# EAGLE schematic boilers (EAGLE 7.2.0)
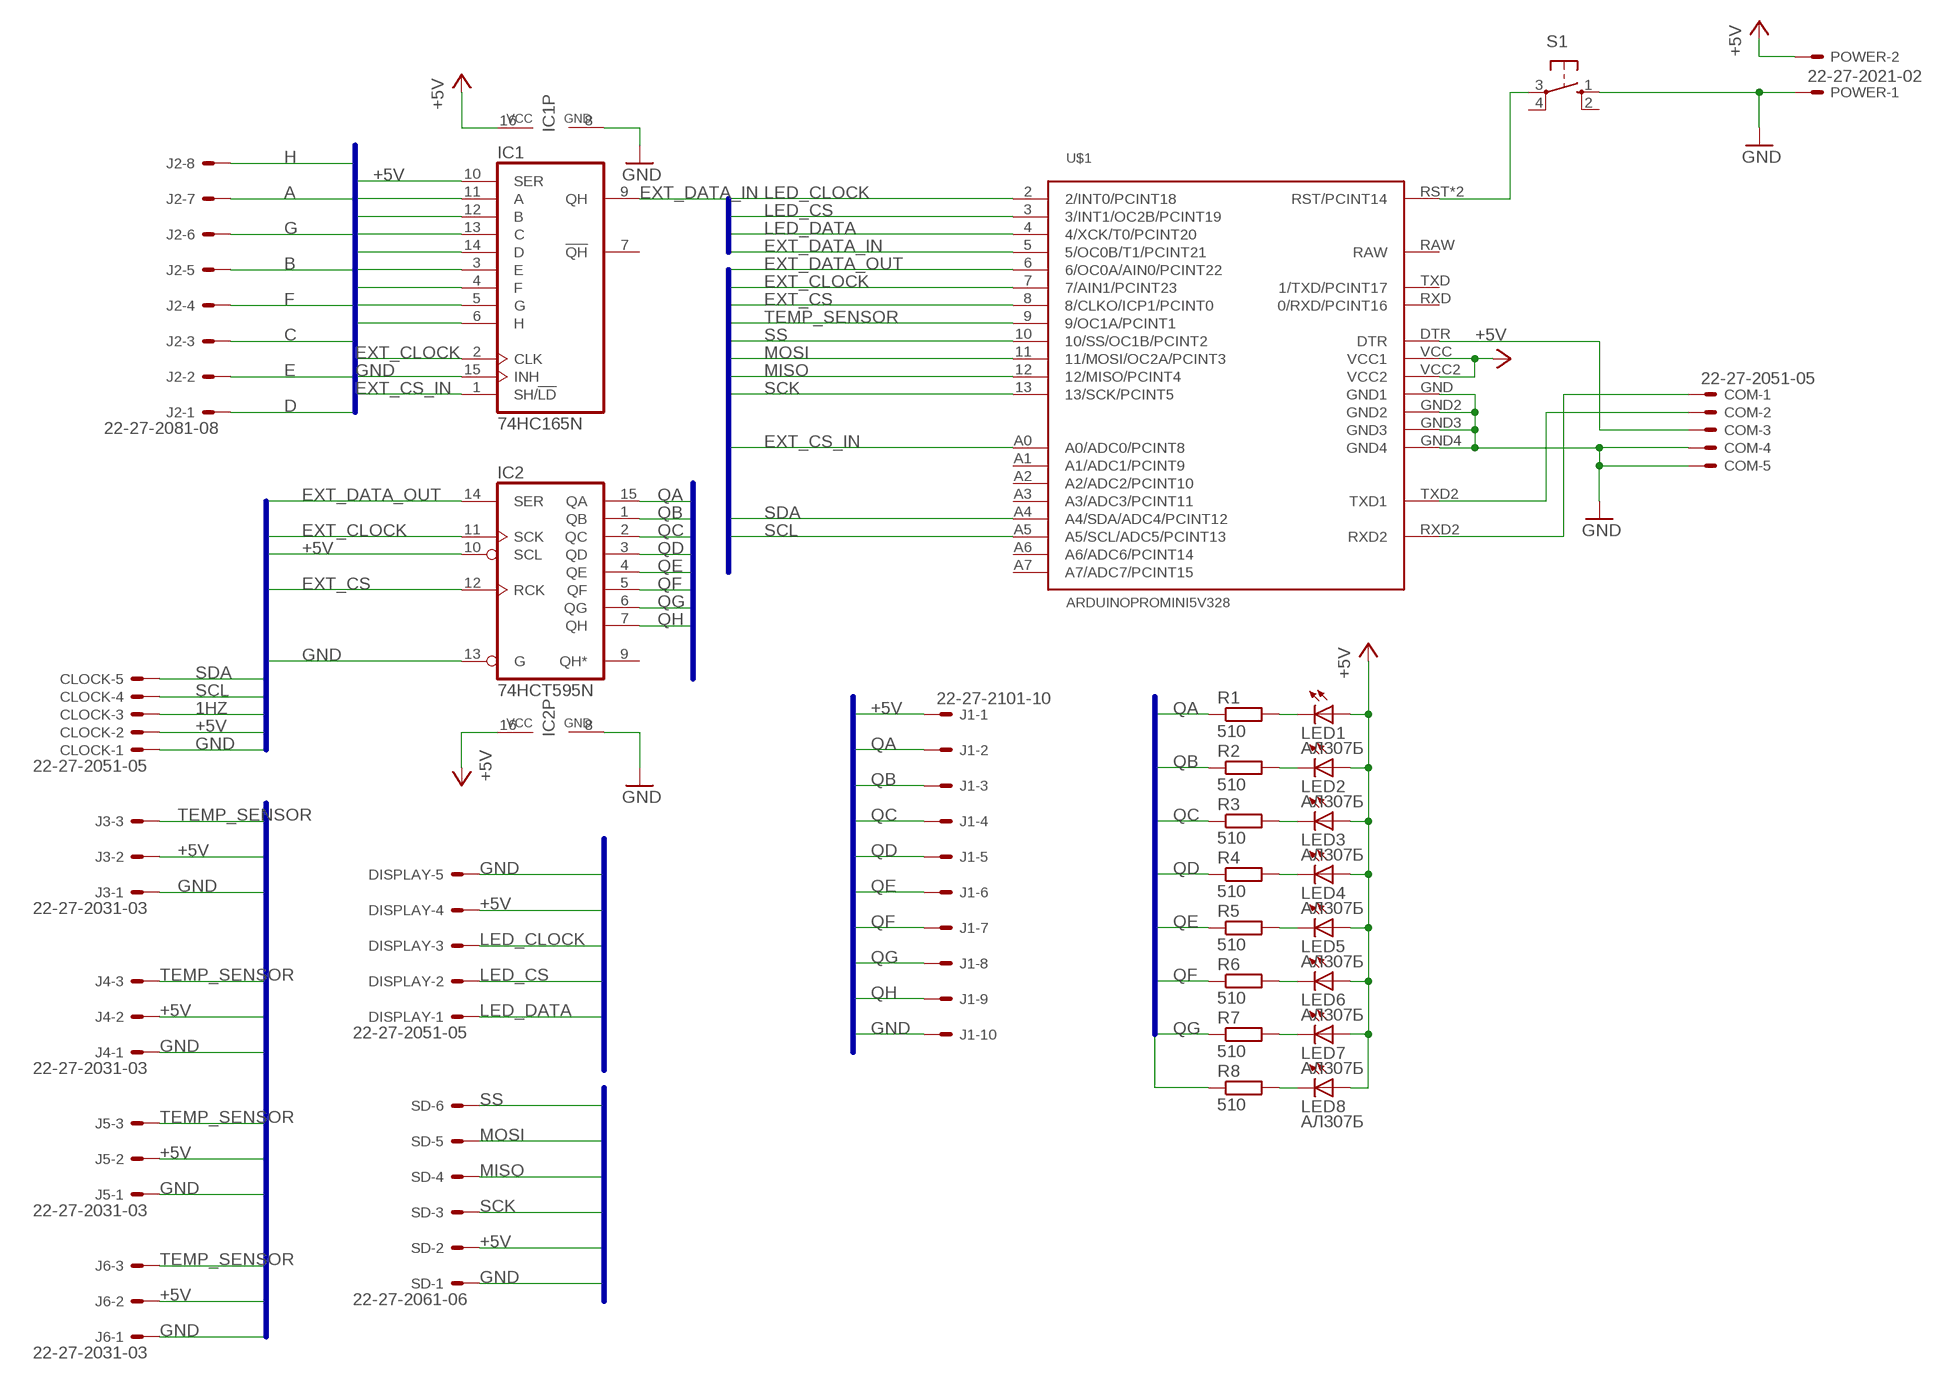
[diagram p0: schematic, sheet 1]

## Parts
CLOCK  22-27-2051-05  [6410-05]
COM  22-27-2051-05  [6410-05]
DISPLAY  22-27-2051-05  [6410-05]
IC1  74HC165N  [DIL16]
IC2  74HCT595N  [DIL16]
J1  22-27-2101-10  [6410-10]
J2  22-27-2081-08  [6410-08]
J3  22-27-2031-03  [6410-03]
J4  22-27-2031-03  [6410-03]
J5  22-27-2031-03  [6410-03]
J6  22-27-2031-03  [6410-03]
LED1  АЛ307Б  LED5MM  [LED5MM]
LED2  АЛ307Б  LED5MM  [LED5MM]
LED3  АЛ307Б  LED5MM  [LED5MM]
LED4  АЛ307Б  LED5MM  [LED5MM]
LED5  АЛ307Б  LED5MM  [LED5MM]
LED6  АЛ307Б  LED5MM  [LED5MM]
LED7  АЛ307Б  LED5MM  [LED5MM]
LED8  АЛ307Б  LED5MM  [LED5MM]
POWER  22-27-2021-02  [6410-02]
R1  510  R-EU_0207/10  [0207/10]
R2  510  R-EU_0207/10  [0207/10]
R3  510  R-EU_0207/10  [0207/10]
R4  510  R-EU_0207/10  [0207/10]
R5  510  R-EU_0207/10  [0207/10]
R6  510  R-EU_0207/10  [0207/10]
R7  510  R-EU_0207/10  [0207/10]
R8  510  R-EU_0207/10  [0207/10]
S1  10-XX  [B3F-10XX]
SD  22-27-2061-06  [6410-06]
U$1  ARDUINOPROMINI5V328  [ARDUINOMINIPRO5V328]

## Nets
1HZ: CLOCK.3
+5V [power]: CLOCK.2 DISPLAY.4 IC1.10(SER) IC1.16(VCC) IC2.10(SCL) IC2.16(VCC) J1.1 J3.2 J4.2 J5.2 J6.2 LED1.A LED2.A LED3.A LED4.A LED5.A LED6.A LED7.A LED8.A POWER.2 SD.2 U$1.VCC2 U$1.VCC(VCC1)
A: IC1.11(A) J2.7
B: IC1.12(B) J2.5
C: IC1.13(C) J2.3
D: IC1.14(D) J2.1
E: IC1.3(E) J2.2
EXT_CLOCK: IC1.2(CLK) IC2.11(SCK) U$1.7(7/AIN1/PCINT23)
EXT_CS: IC2.12(RCK) U$1.8(8/CLKO/ICP1/PCINT0)
EXT_CS_IN: IC1.1(SH/!LD) U$1.A0(A0/ADC0/PCINT8)
EXT_DATA_IN: IC1.9(QH) U$1.5(5/OC0B/T1/PCINT21)
EXT_DATA_OUT: IC2.14(SER) U$1.6(6/OC0A/AIN0/PCINT22)
F: IC1.4(F) J2.4
G: IC1.5(G) J2.6
GND [power]: CLOCK.1 COM.4 COM.5 DISPLAY.5 IC1.8(GND) IC1.15(INH) IC2.8(GND) IC2.13(G) J1.10 J3.1 J4.1 J5.1 J6.1 POWER.1 S1.1(S) SD.1 U$1.GND2 U$1.GND3 U$1.GND4 U$1.GND(GND1)
H: IC1.6(H) J2.8
LED_CLOCK: DISPLAY.3 U$1.2(2/INT0/PCINT18)
LED_CS: DISPLAY.2 U$1.3(3/INT1/OC2B/PCINT19)
LED_DATA: DISPLAY.1 U$1.4(4/XCK/T0/PCINT20)
MISO: SD.4 U$1.12(12/MISO/PCINT4)
MOSI: SD.5 U$1.11(11/MOSI/OC2A/PCINT3)
N$1: COM.1 U$1.RXD2
N$2: COM.3 U$1.DTR
N$3: LED1.K(C) R1.2
N$4: LED2.K(C) R2.2
N$6: LED3.K(C) R3.2
N$7: LED4.K(C) R4.2
N$8: LED5.K(C) R5.2
N$9: LED6.K(C) R6.2
N$10: LED7.K(C) R7.2
N$11: LED8.K(C) R8.2
QA: IC2.15(QA) J1.2 R1.1
QB: IC2.1(QB) J1.3 R2.1
QC: IC2.2(QC) J1.4 R3.1
QD: IC2.3(QD) J1.5 R4.1
QE: IC2.4(QE) J1.6 R5.1
QF: IC2.5(QF) J1.7 R6.1
QG: IC2.6(QG) J1.8 R7.1
QH: IC2.7(QH) J1.9 R8.1
RESET: S1.3(P) U$1.RST2(RST/PCINT14) U$1.RST(RST/PCINT14)
SCK: SD.3 U$1.13(13/SCK/PCINT5)
SCL: CLOCK.4 U$1.A5(A5/SCL/ADC5/PCINT13)
SDA: CLOCK.5 U$1.A4(A4/SDA/ADC4/PCINT12)
SS: SD.6 U$1.10(10/SS/OC1B/PCINT2)
TEMP_SENSOR: J3.3 J4.3 J5.3 J6.3 U$1.9(9/OC1A/PCINT1)
TXD: COM.2 U$1.TXD2(TXD1)
Unconnected: IC1.7(!QH) IC2.9(QH*) S1.2(S1) S1.4(P1) U$1.A1(A1/ADC1/PCINT9) U$1.A2(A2/ADC2/PCINT10) U$1.A3(A3/ADC3/PCINT11) U$1.A6(A6/ADC6/PCINT14) U$1.A7(A7/ADC7/PCINT15) U$1.RAW U$1.RXD(0/RXD/PCINT16) U$1.TXD(1/TXD/PCINT17)

## Buses
A,B,C,D,E,F,G,H,GND,+5V,BOILER,PUMP,EXT_CLOCK,TEMP_SENSOR,SDA,SCL,1HZ,LED_DATA,LED_CS,LED_CLOCK,SS,MOSI,MISO,SCK,EXT_DATA_OUT,LOAD,EXT_CS_IN,EXT_CS,EXT_DATA_IN
QA,QB,QC,QD,QE,QF,QG,QH,+5V,GND

## Library data of the parts
CLOCK COM DISPLAY = con-molex:22-?-05: CONNECTOR wire to board 2.54 mm (.1 inch) pitch header; OC_FARNELL: unknown; OC_NEWARK: unknown
IC1 = 74xx-eu:74*165: 8-bit parallel load SHIFT REGISTER
IC2 = 74xx-eu:74*595: 8-bit SHIFT REGISTER, output latch
J1 = con-molex:22-?-10: CONNECTOR wire to board 2.54 mm (.1 inch) pitch header; OC_FARNELL: unknown; OC_NEWARK: unknown
J2 = con-molex:22-?-08: CONNECTOR wire to board 2.54 mm (.1 inch) pitch header; OC_FARNELL: unknown; OC_NEWARK: unknown
J3-J6 = con-molex:22-?-03: CONNECTOR wire to board 2.54 mm (.1 inch) pitch header; OC_FARNELL: unknown; OC_NEWARK: unknown
LED1-LED8 = led:LED: LED OSRAM: - CHIPLED LG R971, LG N971, LY N971, LG Q971, LY Q971, LO R971, LY R971 LH N974, LH R974 LS Q976, LO Q976, LY Q976 LO Q996 - Hyper CHIPLED LW Q18S LB Q993, LB Q99A, LB R99A - SideLED LS A670, LO A670, LY A670, LG A670, LP A670 LB A673, LV A673, LT A673, LW A673 LH A674 LY A675 LS A676, LA A676, LO A676, LY A676, LW A676 LS A679, LY A679, LG A679 - Hyper Micro SIDELED® LS Y876, LA Y876, LO Y876, LY Y876 LT Y87S - SmartLED LW L88C, LW L88S LB L89C, LB L89S, LG L890 LS L89K, LO L89K, LY L89K LS L896, LA L896, LO L896, LY L896 - TOPLED LS T670, LO T670, LY T670, LG T670, LP T670 LSG T670, LSP T670, LSY T670, LOP T670, LYG T670 LG T671, LOG T671, LSG T671 LB T673, LV T673, LT T673, LW T673 LH T674 LS T676, LA T676, LO T676, LY T676, LB T676, LH T676, LSB T676, LW T676 LB T67C, LV T67C, LT T67C, LS T67K, LO T67K, LY T67K, LW E67C LS E67B, LA E67B, LO E67B, LY E67B, LB E67C, LV E67C, LT E67C LW T67C LS T679, LY T679, LG T679 LS T770, LO T770, LY T770, LG T770, LP T770 LB T773, LV T773, LT T773, LW T773 LH T774 LS E675, LA E675, LY E675, LS T675 LS T776, LA T776, LO T776, LY T776, LB T776 LHGB T686 LT T68C, LB T68C - Hyper Mini TOPLED® LB M676 - Mini TOPLED Santana® LG M470 LS M47K, LO M47K, LY M47K Source: http://www.osram.convergy.de LUXEON: - LUMILED® LXK2-PW12-R00, LXK2-PW12-S00, LXK2-PW14-U00, LXK2-PW14-V00 LXK2-PM12-R00, LXK2-PM12-S00, LXK2-PM14-U00 LXK2-PE12-Q00, LXK2-PE12-R00, LXK2-PE12-S00, LXK2-PE14-T00, LXK2-PE14-U00 LXK2-PB12-K00, LXK2-PB12-L00, LXK2-PB12-M00, LXK2-PB14-N00, LXK2-PB14-P00, LXK2-PB14-Q00 LXK2-PR12-L00, LXK2-PR12-M00, LXK2-PR14-Q00, LXK2-PR14-R00 LXK2-PD12-Q00, LXK2-PD12-R00, LXK2-PD12-S00 LXK2-PH12-R00, LXK2-PH12-S00 LXK2-PL12-P00, LXK2-PL12-Q00, LXK2-PL12-R00 Source: www.luxeon.com KINGBRIGHT: KA-3528ASYC Source: www.kingbright.com
POWER = con-molex:22-?-02: CONNECTOR wire to board 2.54 mm (.1 inch) pitch header; OC_FARNELL: unknown; OC_NEWARK: unknown
R1-R8 = rcl:R-EU_: RESISTOR, European symbol
S1 = switch-omron:10-XX: OMRON SWITCH; MPN: B3F-1000; OC_FARNELL: 176432; OC_NEWARK: 36M3542
SD = con-molex:22-?-06: CONNECTOR wire to board 2.54 mm (.1 inch) pitch header; OC_FARNELL: unknown; OC_NEWARK: unknown
U$1 = arduino:ARDUINOPROMINI5V328

## Net classes
0 default: width 0.508 mm, clearance 0.508 mm
1 power: width 0.635 mm, drill 0.381 mm, clearance 0.635 mm